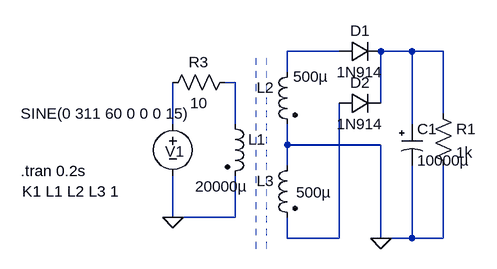
[diagram p0: schematic CenterTapTransformerRectifier.asc]
CenterTapTransformerRectifier.asc, the LTspice schematic file:
Version 4
SHEET 1 880 680
WIRE 144 16 64 16
WIRE 256 16 208 16
WIRE 304 16 256 16
WIRE 64 48 64 16
WIRE -16 64 -32 64
WIRE 208 96 208 16
WIRE 304 112 304 16
WIRE -112 128 -112 64
WIRE -16 128 -16 64
WIRE 256 128 256 16
WIRE 64 160 64 128
WIRE 208 160 64 160
WIRE 64 192 64 160
WIRE -112 272 -112 208
WIRE -16 272 -16 208
WIRE -16 272 -112 272
WIRE 64 304 64 272
WIRE 144 304 144 96
WIRE 144 304 64 304
WIRE 208 304 208 160
WIRE 256 304 256 192
WIRE 256 304 208 304
WIRE 304 304 304 192
WIRE 304 304 256 304
FLAG -112 272 0
FLAG 208 304 0
SYMBOL ind2 -32 112 R0
WINDOW 3 -46 112 Left 2
SYMATTR InstName L1
SYMATTR Value 20000µ
SYMATTR Type ind
SYMBOL ind2 80 32 M0
WINDOW 3 -47 23 Left 2
SYMATTR InstName L2
SYMATTR Value 500µ
SYMATTR Type ind
SYMBOL ind2 80 176 M0
WINDOW 3 -52 57 Left 2
SYMATTR InstName L3
SYMATTR Value 500µ
SYMATTR Type ind
SYMBOL voltage -112 112 R0
WINDOW 0 -12 58 Left 2
WINDOW 3 -234 0 Left 2
WINDOW 123 -93 45 Left 2
WINDOW 39 0 0 Left 0
SYMATTR InstName V1
SYMATTR Value SINE(0 311 60 0 0 0 15)
SYMBOL res -16 48 R90
WINDOW 0 0 56 VBottom 2
WINDOW 3 32 56 VTop 2
SYMATTR InstName R3
SYMATTR Value 10
SYMBOL diode 144 32 R270
WINDOW 0 32 32 VTop 2
WINDOW 3 0 32 VBottom 2
SYMATTR InstName D1
SYMATTR Value 1N914
SYMBOL diode 144 112 R270
WINDOW 0 32 32 VTop 2
WINDOW 3 0 32 VBottom 2
SYMATTR InstName D2
SYMATTR Value 1N914
SYMBOL res 288 96 R0
SYMATTR InstName R1
SYMATTR Value 1k
SYMBOL polcap 240 128 R0
WINDOW 3 24 56 Left 2
SYMATTR InstName C1
SYMATTR Value 10000µ
SYMATTR Description Capacitor
SYMATTR Type cap
SYMATTR SpiceLine V=50 Irms=1.885 Rser=0.033 Lser=0
TEXT -344 232 Left 2 !K1 L1 L2 L3 1
TEXT -346 200 Left 2 !.tran 0.2s
LINE Normal 16 320 16 16 2
LINE Normal 32 320 32 16 2

The netlist it stands for:
* CenterTapTransformerRectifier.asc
L1 N003 0 20000µ
L2 N001 0 500µ
L3 0 N005 500µ
V1 N004 0 SINE(0 311 60 0 0 0 15)
R3 N003 N004 10
D1 N001 N002 1N914
D2 N005 N002 1N914
R1 N002 0 1k
C1 N002 0 10000µ V=50 Irms=1.885 Rser=0.033 Lser=0
.model D D
.lib standard.dio
K1 L1 L2 L3 1
.tran 0.2s
.backanno
.end